# Altium project CHAS_CTRL_G0.PrjPcb
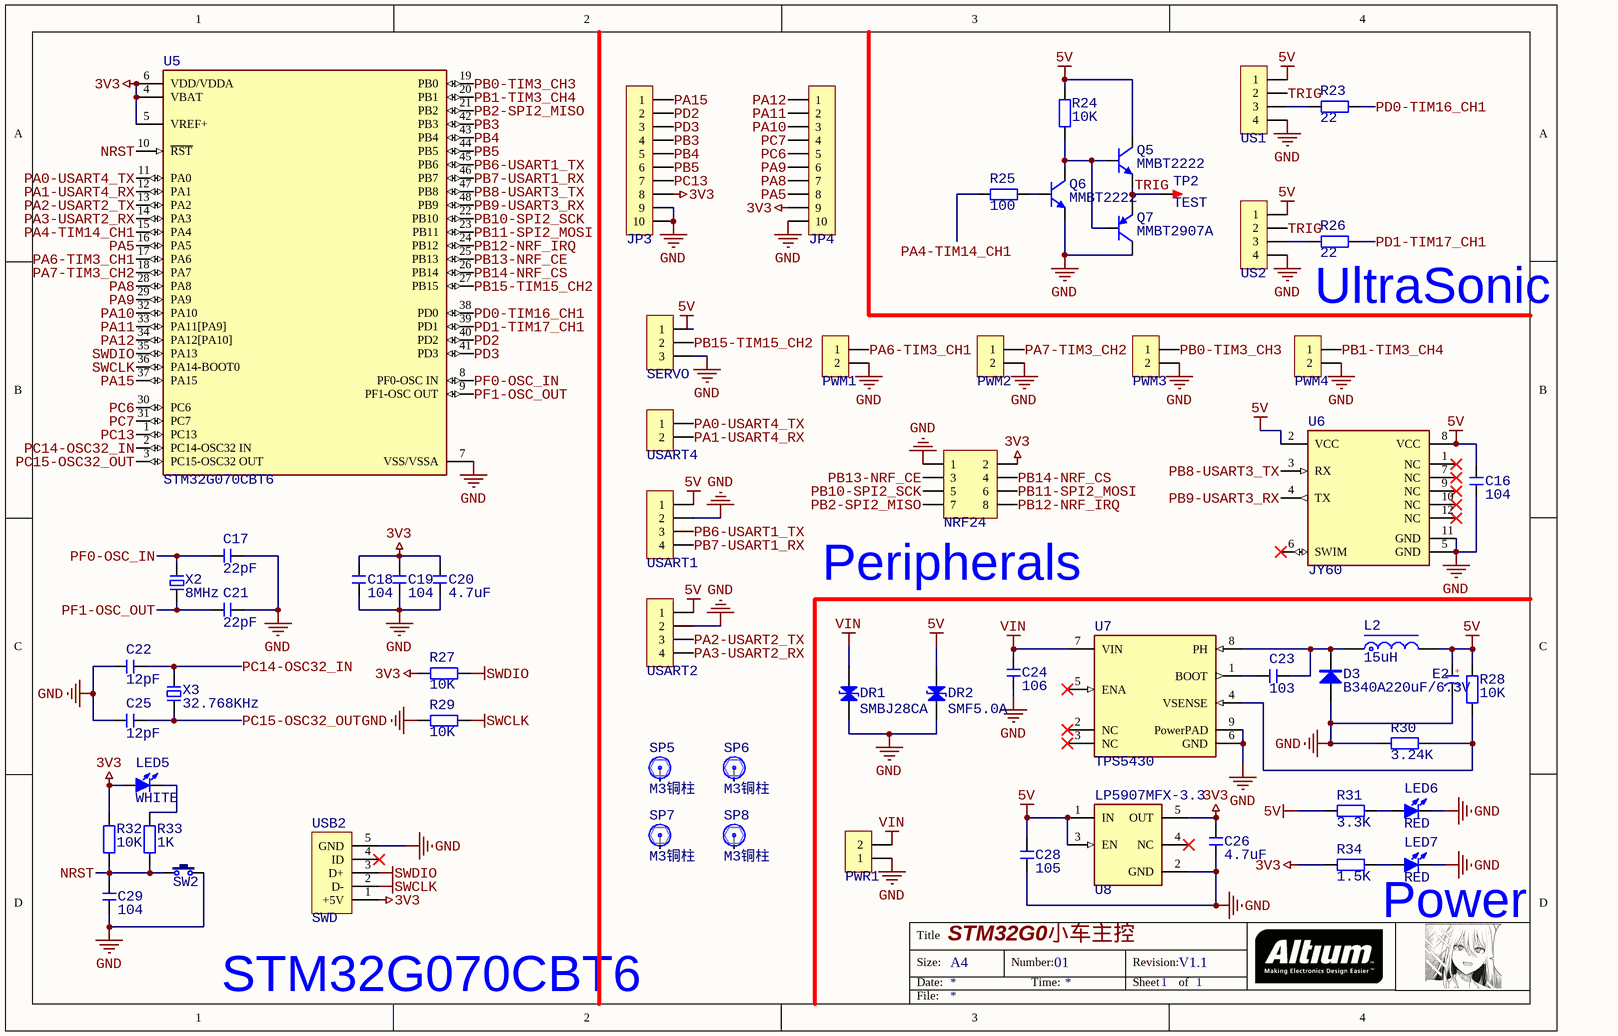
[diagram p0: Main_Control_V1.1.SchDoc]
1 sheet, 63 parts. Net scope: global (net labels, ports and power ports of the same name join across sheets).
Board files: CHAS_CTRL_G0.PcbDoc, CHAS_CTRL_G0_V1.1.PcbDoc

## Sheet Main_Control_V1.1.SchDoc: STM32G0小车主控
size A4; DrawnBy: Lin; Engineer: Lin; DocumentNumber: 01; Revision: V1.1; SheetNumber: 1; SheetTotal: 1

### Parts
C16  104  [C 0603_L]
C17  22pF  [C 0603_L]
C18  104  [C 0402_L]
C19  104  [C 0402_L]
C20  4.7uF  [C 0402_L]
C21  22pF  [C 0603_L]
C22  12pF  [C 0603_L]
C23  103  [C 0603_L]
C24  106  [C 0805_L]
C25  12pF  [C 0603_L]
C26  4.7uF  [C 0603_L]
C28  105  [C 0603_L]
C29  104  [C 0603_L]
D3  B340A  [SMA]
DR1  SMBJ28CA  [SMB]
DR2  SMF5.0A  [SOD-323]
E2  220uF/6.3V  [CD B(3528)]
JP3  HDR-1X10  [HDR2.54-LI-10P]  (value not drawn)
JP4  HDR-1X10  [HDR2.54-LI-10P]  (value not drawn)
L2  15uH  [CDRH73]
LED5  WHITE  [LED 0603W]
LED6  RED  [LED 0603R]
LED7  RED  [LED 0603R]
NRF24  E01C-ML01D  [HDR2.54-LI-2x4P]  (value not drawn)
PWM1  HDR-1X2  [GH1.25-LS-2P]  (value not drawn)
PWM2  HDR-1X2  [GH1.25-LS-2P]  (value not drawn)
PWM3  HDR-1X2  [GH1.25-LS-2P]  (value not drawn)
PWM4  HDR-1X2  [GH1.25-LS-2P]  (value not drawn)
PWR1  绿头卧式2P  [15EDGVM-02P-3.81mm]  (value not drawn)
Q5  MMBT2222  [SOT23-3L]
Q6  MMBT2222  [SOT23-3L]
Q7  MMBT2907A  [SOT23-3L]
R23  22  [R 0603_L]
R24  10K  [R 0603_L]
R25  100  [R 0603_L]
R26  22  [R 0603_L]
R27  10K  [R 0603_L]
R28  10K  [R 0603_L]
R29  10K  [R 0603_L]
R30  3.24K  [R 0603_L]
R31  3.3K  [R 0603_L]
R32  10K  [R 0603_L]
R33  1K  [R 0603_L]
R34  1.5K  [R 0603_L]
SERVO  HDR-1X3  [XH2.54-LS-3P]  (value not drawn)
SP5  M3铜柱  [M3x8_L]
SP6  M3铜柱  [M3x8_L]
SP7  M3铜柱  [M3x8_L]
SP8  M3铜柱  [M3x8_L]
SW2  6x6x5  [TS 2PIN 6x6x4.8]  (value not drawn)
TP2  TEST  [TEST 1]
U5  STM32G070CBT6  [STMicroelectronics_LQFP48-5B_MFG]
U6  JY60  [JY60]
U7  TPS5430  [Texas_Instruments_DDA0008J_IPC_C]
U8  LP5907MFX-3.3  [Diodes_SOT25_MFG]
US1  HDR-1X4  [XH2.54-LS-4P]  (value not drawn)
US2  HDR-1X4  [XH2.54-LS-4P]  (value not drawn)
USART1  HDR-1X4  [XH2.54-LS-4P]  (value not drawn)
USART2  HDR-1X4  [XH2.54-LS-4P]  (value not drawn)
USART4  HDR-1X2  [XH2.54-LS-2P]  (value not drawn)
USB2  SWD  [USB-MICRO_C]
X2  8MHz  [OSC 5032-2P]
X3  32.768KHz  [OSC 3215-2P]

### Nets
3V3: C18.2 C19.2 C20.2 C26.2 JP3.8 JP4.9 LED5.1(A) NRF24.2 R27.2 R32.2 R34.1 U5.4(VBAT) U5.5(VREF+) U5.6(VDD/VDDA) U8.5(OUT) USB2.1(+5V)
5V: C16.2 C28.2 DR2.2(K) E2.1(A) L2.2 Q5.3(C) R24.2 R28.2 R31.1 SERVO.1 U6.2(VCC) U6.8(VCC) U8.1(IN) U8.3(EN) US1.1 US2.1 USART1.1 USART2.1
GND: C16.1 C17.1 C18.1 C19.1 C20.1 C21.1 C22.2 C24.1 C25.2 C26.1 C28.1 C29.1 D3.1(A) DR1.2(K) DR2.1(A) E2.2(K) JP3.9 JP3.10 JP4.10 LED6.2(K) LED7.2(K) NRF24.1 PWM1.2 PWM2.2 PWM3.2 PWM4.2 PWR1.1 Q6.2(E) Q7.3(C) R29.2 R30.2 SERVO.3 SW2.2 U5.7(VSS/VSSA) U6.5(GND) U6.11(GND) U7.6(GND) U7.9(PowerPAD) U8.2(GND) US1.4 US2.4 USART1.2 USART2.2 USB2.5(GND)
SWCLK: R29.1 U5.36(PA14-BOOT0) USB2.2(D-)
SWDIO: R27.1 U5.35(PA13) USB2.3(D+)
VIN: C24.2 DR1.1(A) PWR1.2 U7.7(VIN)
NRST: C29.2 R32.1 R33.1 SW2.1 U5.10(~{RST})
PA0-USART4_TX: U5.11(PA0) USART4.1
PA1-USART4_RX: U5.12(PA1) USART4.2
PA2-USART2_TX: U5.13(PA2) USART2.3
PA3-USART2_RX: U5.14(PA3) USART2.4
PA4-TIM14_CH1: R25.1 U5.15(PA4)
PA5: JP4.8 U5.16(PA5)
PA6-TIM3_CH1: PWM1.1 U5.17(PA6)
PA7-TIM3_CH2: PWM2.1 U5.18(PA7)
PA8: JP4.7 U5.28(PA8)
PA9: JP4.6 U5.29(PA9)
PA10: JP4.3 U5.32(PA10)
PA11: JP4.2 U5.33(PA11[PA9])
PA12: JP4.1 U5.34(PA12[PA10])
PA15: JP3.1 U5.37(PA15)
PB0-TIM3_CH3: PWM3.1 U5.19(PB0)
PB1-TIM3_CH4: PWM4.1 U5.20(PB1)
PB2-SPI2_MISO: NRF24.7 U5.21(PB2)
PB3: JP3.4 U5.42(PB3)
PB4: JP3.5 U5.43(PB4)
PB5: JP3.6 U5.44(PB5)
PB6-USART1_TX: U5.45(PB6) USART1.3
PB7-USART1_RX: U5.46(PB7) USART1.4
PB8-USART3_TX: U5.47(PB8) U6.3(RX)
PB9-USART3_RX: U5.48(PB9) U6.4(TX)
PB10-SPI2_SCK: NRF24.5 U5.22(PB10)
PB11-SPI2_MOSI: NRF24.6 U5.23(PB11)
PB12-NRF_IRQ: NRF24.8 U5.24(PB12)
PB13-NRF_CE: NRF24.3 U5.25(PB13)
PB14-NRF_CS: NRF24.4 U5.26(PB14)
PB15-TIM15_CH2: SERVO.2 U5.27(PB15)
PC6: JP4.5 U5.30(PC6)
PC7: JP4.4 U5.31(PC7)
PC13: JP3.7 U5.1(PC13)
PC14-OSC32_IN: C22.1 U5.2(PC14-OSC32_IN) X3.2
PC15-OSC32_OUT: C25.1 U5.3(PC15-OSC32_OUT) X3.1
PD0-TIM16_CH1: R23.2 U5.38(PD0)
PD1-TIM17_CH1: R26.2 U5.39(PD1)
PD2: JP3.2 U5.40(PD2)
PD3: JP3.3 U5.41(PD3)
PF0-OSC_IN: C17.2 U5.8(PF0-OSC_IN) X2.2
PF1-OSC_OUT: C21.2 U5.9(PF1-OSC_OUT) X2.1
TRIG: Q5.2(E) Q7.2(E) TP2.1 US1.2 US2.2
NetC23_1: C23.1 D3.2(K) L2.1 U7.8(PH)
NetC23_2: C23.2 U7.1(BOOT)
NetLED5_2: LED5.2(K) R33.2
NetLED6_1: LED6.1(A) R31.2
NetLED7_1: LED7.1(A) R34.2
NetQ5_1: Q5.1(B) Q6.3(C) Q7.1(B) R24.1
NetQ6_1: Q6.1(B) R25.2
NetR23_1: R23.1 US1.3
NetR26_1: R26.1 US2.3
NetR28_1: R28.1 R30.1 U7.4(VSENSE)

Not connected (* = marked no-connect by the designer): SP5 1; SP6 1; SP7 1; SP8 1; U6 1(NC)* 6(SWIM)* 7(NC)* 9(NC)* 10(NC)* 12(NC)*; U7 2(NC)* 3(NC)* 5(ENA)*; U8 4(NC)*; USB2 4(ID)*

### Notes on the sheet
- (near R26) UltraSonic
- (near NRF24) Peripherals
- (near LED7) Power
- (near USB2) STM32G070CBT6
- Title
- Size:
- Date:
- A4
- Number:
- Time:
- Revision:
- Sheet
- of
- File:
- (in symbol C-CD) +

### Library data of the parts
C16-C26 C28 C29 = C: 无极性贴片电容; 材质: X7R; BOM名称: 无极性贴片电容
D3 = 1N5819: 肖特基二极管; 属性: 40V/2A; BOM名称: 肖特基二极管
DR1 DR2 = DR: 瞬态电压抑制二极管; BOM名称: 瞬态电压抑制二极管
E2 = C-CD: 贴片钽电容; BOM名称: 贴片钽电容
JP3 JP4 = Header 10: 10P接插件; BOM名称: 10P接插件
L2 = L-CDRH: 功率屏蔽电感; BOM名称: 功率屏蔽电感
LED5-LED7 = LED-SMD: 贴片LED; BOM名称: 贴片LED
NRF24 = Header 4X2: 4*2P接插件; BOM名称: 4*2P接插件
PWM1-PWM4 USART4 = Header 2: 2P接插件; BOM名称: 2P接插件
PWR1 = 绿头卧式2P: 3.81间距
Q5 Q6 = MMBTA42: 高压-NPN型; 属性: 300V 0.5A; BOM名称: 高压-NPN型
Q7 = 8550-SMD: 高频放大-PNP型; 属性: 40V 1.5A 1W 100MHZ; BOM名称: 高频放大-PNP型
R23-R34 = R: 贴片电阻; BOM名称: 贴片电阻
SERVO = Header 3: 3P接插件; BOM名称: 3P接插件
SP5-SP8 = 铜柱小焊盘: 铜柱; BOM名称: 铜柱
SW2 = TSW SMD-2Pin-6x6: 2脚贴片6x6无声硅胶轻触开关; BOM名称: 2脚轻触开关
TP2 = TEST: 测试点; BOM名称: 测试点
U5 = STM32G070CBT6: Arm® Cortex®-M0+ 32-bit MCU, 128 KB Flash, 36 KB RAM, / 4x USART, timers, ADC, comm. I/Fs, 2.0-3.6V
U6 = JY60: ICM-42605 六轴姿态测量传感器
U7 = TPS5430DDA: 5.5V to 36V Input, 3A, 500kHz Step-Down Converter 8-SO PowerPAD 0 to 0
U8 = LP5907MFX-3.3-NOPB: 250-mA ultra-low-noise low-IQ low-dropout (LDO) linear regulator 5-SOT-23 -40 to 125
US1 US2 USART1 USART2 = Header 4: 4P接插件; BOM名称: 4P接插件
USB2 = USB-5P: 微型USB母座; BOM名称: 微型USB母座
X2 X3 = XTAL-2P: 2脚无源脚晶振; 负载电容: CL20pF; BOM名称: 2脚无源脚晶振